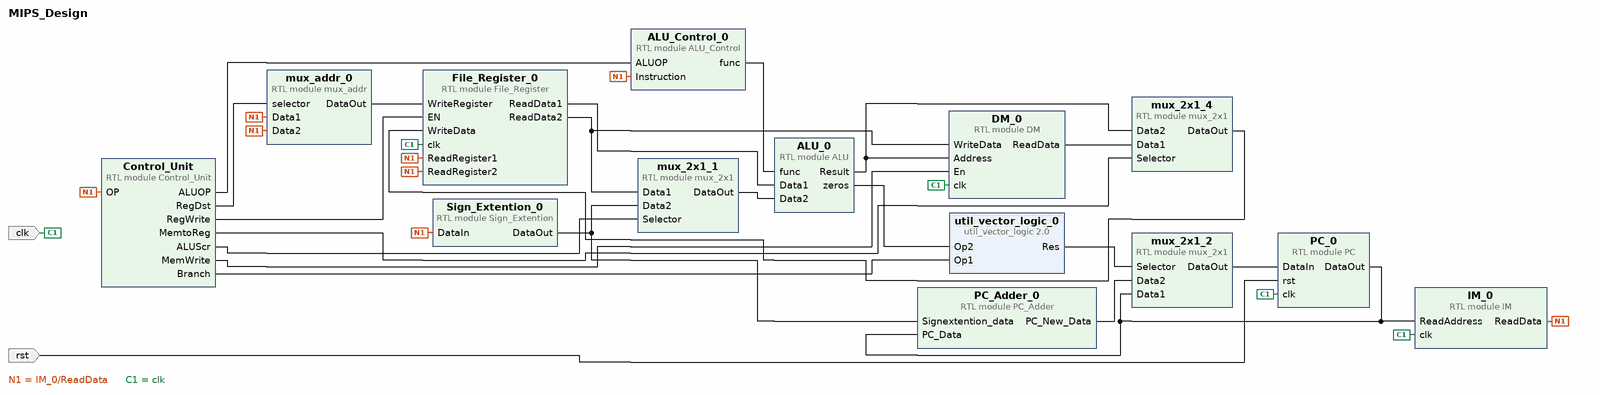
[diagram p0: block diagram of the top level]
# Vivado block design MIPS_Design, xc7vx415tffg1158-2, Vivado 2018.3
create_bd_design MIPS_Design

create_bd_port -dir I -type clk clk
set_property -dict {CONFIG.FREQ_HZ 100000000} [get_bd_ports clk]
create_bd_port -dir I -type rst rst
set_property -dict {CONFIG.POLARITY ACTIVE_HIGH} [get_bd_ports rst]

create_bd_cell -type module -reference IM IM_0
create_bd_cell -type module -reference Sign_Extention Sign_Extention_0
create_bd_cell -type module -reference PC_Adder PC_Adder_0
create_bd_cell -type ip -vlnv xilinx.com:ip:util_vector_logic:2.0 util_vector_logic_0
set_property -dict {CONFIG.C_SIZE 1} [get_bd_cells util_vector_logic_0]
create_bd_cell -type module -reference ALU_Control ALU_Control_0
create_bd_cell -type module -reference Control_Unit Control_Unit
create_bd_cell -type module -reference ALU ALU_0
create_bd_cell -type module -reference mux_2x1 mux_2x1_1
create_bd_cell -type module -reference mux_2x1 mux_2x1_4
create_bd_cell -type module -reference mux_2x1 mux_2x1_2
create_bd_cell -type module -reference File_Register File_Register_0
create_bd_cell -type module -reference mux_addr mux_addr_0
create_bd_cell -type module -reference PC PC_0
create_bd_cell -type module -reference DM DM_0

# ---- connections ----

connect_bd_net [get_bd_pins IM_0/ReadData] \
  [get_bd_pins ALU_Control_0/Instruction] [get_bd_pins Control_Unit/OP] [get_bd_pins Sign_Extention_0/DataIn] \
  [get_bd_pins File_Register_0/ReadRegister1] [get_bd_pins File_Register_0/ReadRegister2] [get_bd_pins mux_addr_0/Data1] \
  [get_bd_pins mux_addr_0/Data2]
connect_bd_net [get_bd_pins File_Register_0/ReadData2] [get_bd_pins mux_2x1_1/Data1] [get_bd_pins DM_0/WriteData]
connect_bd_net [get_bd_pins mux_2x1_1/DataOut] [get_bd_pins ALU_0/Data2]
connect_bd_net [get_bd_pins File_Register_0/ReadData1] [get_bd_pins ALU_0/Data1]
connect_bd_net [get_bd_pins ALU_0/Result] [get_bd_pins mux_2x1_4/Data2] [get_bd_pins DM_0/Address]
connect_bd_net [get_bd_pins DM_0/ReadData] [get_bd_pins mux_2x1_4/Data1]
connect_bd_net -net Control_Unit_0_RegDst [get_bd_pins Control_Unit/RegDst] [get_bd_pins mux_addr_0/selector]
connect_bd_net -net Control_Unit_0_MemtoReg [get_bd_pins Control_Unit/MemtoReg] [get_bd_pins mux_2x1_4/Selector]
connect_bd_net -net Control_Unit_0_RegWrite [get_bd_pins Control_Unit/RegWrite] [get_bd_pins File_Register_0/EN]
connect_bd_net [get_bd_pins Sign_Extention_0/DataOut] [get_bd_pins PC_Adder_0/Signextention_data] [get_bd_pins mux_2x1_1/Data2]
connect_bd_net -net Control_Unit_0_ALUScr [get_bd_pins Control_Unit/ALUScr] [get_bd_pins mux_2x1_1/Selector]
connect_bd_net [get_bd_pins mux_2x1_4/DataOut] [get_bd_pins File_Register_0/WriteData]
connect_bd_net [get_bd_pins PC_0/DataOut] [get_bd_pins IM_0/ReadAddress] [get_bd_pins PC_Adder_0/PC_Data] [get_bd_pins mux_2x1_2/Data1]
connect_bd_net [get_bd_pins PC_Adder_0/PC_New_Data] [get_bd_pins mux_2x1_2/Data2]
connect_bd_net -net Control_Unit_0_ALUOP [get_bd_pins Control_Unit/ALUOP] [get_bd_pins ALU_Control_0/ALUOP]
connect_bd_net [get_bd_pins ALU_Control_0/func] [get_bd_pins ALU_0/func]
connect_bd_net -net Control_Unit_0_MemRead [get_bd_pins Control_Unit/MemWrite] [get_bd_pins DM_0/En]
connect_bd_net -net Control_Unit_0_Branch [get_bd_pins Control_Unit/Branch] [get_bd_pins util_vector_logic_0/Op1]
connect_bd_net [get_bd_pins util_vector_logic_0/Res] [get_bd_pins mux_2x1_2/Selector]
connect_bd_net [get_bd_pins ALU_0/zeros] [get_bd_pins util_vector_logic_0/Op2]
connect_bd_net [get_bd_ports clk] [get_bd_pins IM_0/clk] [get_bd_pins File_Register_0/clk] [get_bd_pins PC_0/clk] [get_bd_pins DM_0/clk]
connect_bd_net [get_bd_pins mux_2x1_2/DataOut] [get_bd_pins PC_0/DataIn]
connect_bd_net [get_bd_pins mux_addr_0/DataOut] [get_bd_pins File_Register_0/WriteRegister]
connect_bd_net [get_bd_ports rst] [get_bd_pins PC_0/rst]

validate_bd_design
save_bd_design
